# EAGLE design nice n simple 3340 v3 (EAGLE 9.6.2)
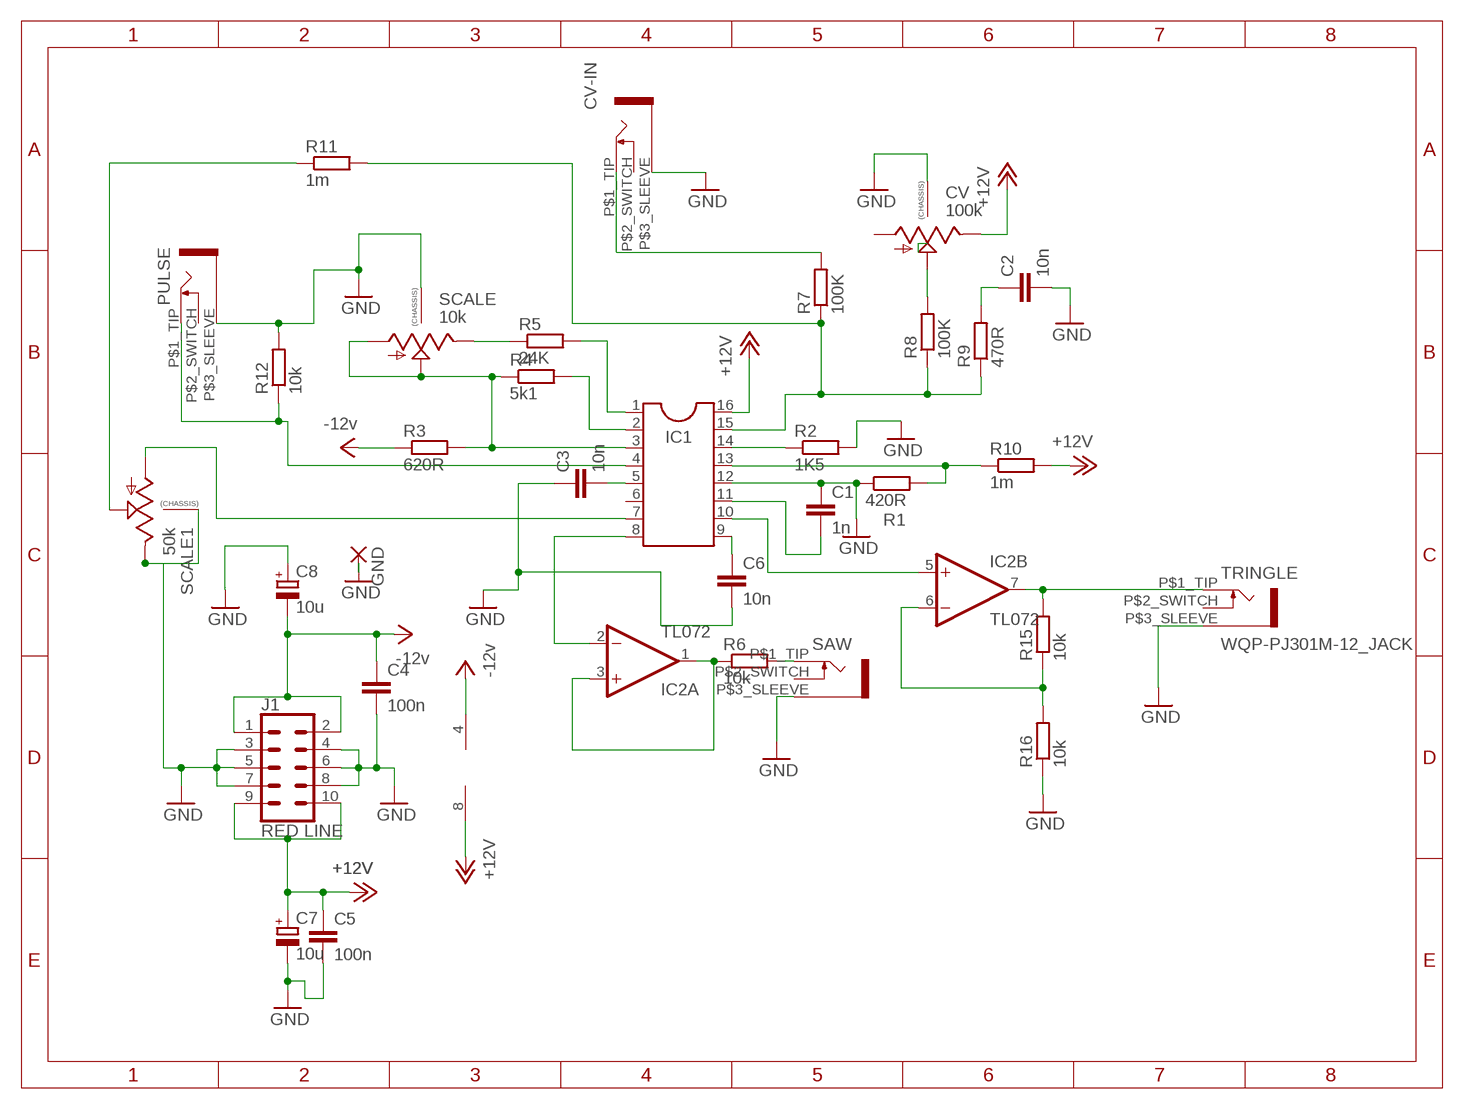
[diagram p0: schematic, sheet 1]

## Parts
C1  1n  C5/2.5  [C5B2.5]
C2  10n  C5/2.5  [C5B2.5]
C3  10n  C5/2.5  [C5B2.5]
C4  100n  C5/2.5  [C5B2.5]
C5  100n  C5/2.5  [C5B2.5]
C6  10n  C5/2.5  [C5B2.5]
C7  10u  CPOL-EUE1.8-4  [E1,8-4]
C8  10u  CPOL-EUE1.8-4  [E1,8-4]
CV  100k  9MM_SNAP-IN_POT_CHASSIS  [9MM_SNAP-IN_POT]
CV-IN  WQP-PJ301M-12_JACK  [WQP-PJ301M-12_JACK]
GND  WIREPAD1,6/0,9  [1,6/0,9]
IC1  CEM3340  DIL16S  [SOCKET-16]
IC2  TL072  TL072P  [DIL08]
J1  RED LINE  CONN_05X2SHD-NS  [2X5-SHROUDED-NS]
PULSE  WQP-PJ301M-12_JACK  [WQP-PJ301M-12_JACK]
R1  420R  R-EU_0207/7  [0207/7]
R2  1K5  R-EU_0207/7  [0207/7]
R3  620R  R-EU_0207/7  [0207/7]
R4  5k1  R-EU_0207/7  [0207/7]
R5  24K  R-EU_0207/7  [0207/7]
R6  10k  R-EU_0207/7  [0207/7]
R7  100K  R-EU_0207/7  [0207/7]
R8  100K  R-EU_0207/7  [0207/7]
R9  470R  R-EU_0207/7  [0207/7]
R10  1m  R-EU_0207/7  [0207/7]
R11  1m  R-EU_0207/7  [0207/7]
R12  10k  R-EU_0207/7  [0207/7]
R15  10k  R-EU_0207/7  [0207/7]
R16  10k  R-EU_0207/7  [0207/7]
SAW  WQP-PJ301M-12_JACK  [WQP-PJ301M-12_JACK]
SCALE  10k  9MM_SNAP-IN_POT_CHASSIS  [9MM_SNAP-IN_POT]
SCALE1  50k  9MM_SNAP-IN_POT_CHASSIS  [9MM_SNAP-IN_POT]
TRINGLE  WQP-PJ301M-12_JACK  [WQP-PJ301M-12_JACK]

## Nets
+12V: C5.1 C7.+ CV.3(E) IC1.16 IC2.8(P:V+) J1.9 J1.10 R10.2
-12V: C4.1 C8.- IC2.4(P:V-) J1.1 J1.2 R3.1 ; supply symbol labelled -12v
GND: C1.1 C2.2 C3.1 C4.2 C5.2 C6.2 C7.- C8.+ CV-IN.P$3_SLEEVE CV.CHASSIS1 CV.CHASSIS2 GND.1(P) IC1.12 J1.3 J1.4 J1.5 J1.6 J1.7 J1.8 PULSE.P$3_SLEEVE R1.1 R2.2 R12.2 R16.1 SAW.P$3_SLEEVE SCALE1.3(E) SCALE1.CHASSIS1 SCALE1.CHASSIS2 SCALE.CHASSIS1 SCALE.CHASSIS2 TRINGLE.P$3_SLEEVE
N$1: R5.1 SCALE.3(E)
N$2: IC1.3 R3.2 R4.1 SCALE.1(A) SCALE.2(S)
N$3: C1.2 IC1.11
N$4: IC1.15 R7.1 R8.1 R9.1 R11.2
N$5: IC1.13 R1.2 R10.1
N$6: IC1.14 R2.1
N$7: IC1.4 PULSE.P$1_TIP R12.1
N$8: IC1.2 R4.2
N$9: C6.1 IC1.9
N$10: C3.2 IC1.5
N$11: IC1.1 R5.2
N$12: IC2.6(B:-IN) R15.1 R16.2
N$13: IC1.8 IC2.2(A:-IN)
N$14: CV-IN.P$1_TIP R7.2
N$15: IC1.10 IC2.5(B:+IN)
N$16: IC2.1(A:OUT) IC2.3(A:+IN) R6.1
N$18: R6.2 SAW.P$1_TIP
N$20: IC2.7(B:OUT) R15.2 TRINGLE.P$1_TIP
N$22: IC1.7 SCALE1.1(A)
N$23: R11.1 SCALE1.2(S)
N$25: C2.1 R9.2
N$26: CV.2(S) R8.2
Unconnected: CV-IN.P$2_SWITCH CV.1(A) IC1.6 PULSE.P$2_SWITCH SAW.P$2_SWITCH TRINGLE.P$2_SWITCH

## Library data of the parts
C1-C6 = hexcapacitor-wima:C: CAPACITOR naming: grid - package width
C7 C8 = hexresistor:CPOL-EU: POLARIZED CAPACITOR, European symbol; SPICEPREFIX: C
CV SCALE SCALE1 = MusicThingModular:9MM_SNAP-IN_POT_CHASSIS: 9mm vertical snap-in pot, Alpha / Panasonic style, with a connection to the metal chassis for grounding
CV-IN PULSE SAW TRINGLE = MusicThingModular:WQP-PJ301M-12_JACK
GND = wirepad:WIREPAD: Wire PAD connect wire on PCB
IC1 = ic-package:DIL16: Dual In Line / Socket
IC2 = linear:TL072: OP AMP
J1 = SparkFun-Connectors:CONN_05X2: Multi connection point. Often used as Generic Header-pin footprint for 0.1 inch spaced/style header connections For AVR SPI programming port, see special device with nice symbol: "AVR_SPI_PROG_5x2.dev" You can populate with any combo of single row headers, but if you'd like an exact match, check these: 2x5 AVR ICSP Male Header <https://www.sparkfun.com/products/778> (PRT-00778) 2x5 Pin Shrouded Header <https://www.sparkfun.com/products/8506> (PRT-08506) On any of the 0.1 inch spaced packages, you can populate with these: Break Away Headers - Straight <https://www.sparkfun.com/products/116> (PRT-00116) Break Away Male Headers - Right Angle <https://www.sparkfun.com/products/553> (PRT-00553) Female Headers <https://www.sparkfun.com/products/115> (PRT-00115) Break Away Headers - Machine Pin <https://www.sparkfun.com/products/117> (PRT-00117) Break Away Female Headers - Swiss Machine Pin <https://www.sparkfun.com/products/743> (PRT-00743) Special note: the shrouded connector mates well with our 5x2 ribbon cables: 2x5 Pin IDC Ribbon Cable <https://www.sparkfun.com/products/8535> (PRT-08535); PROD_ID: CONN-08671; SF_ID: PRT-08506
R1-R12 R15 R16 = hexresistor:R-EU_: RESISTOR, European symbol; SPICEPREFIX: R

## Net classes
0 default: width 0.305 mm

## Board
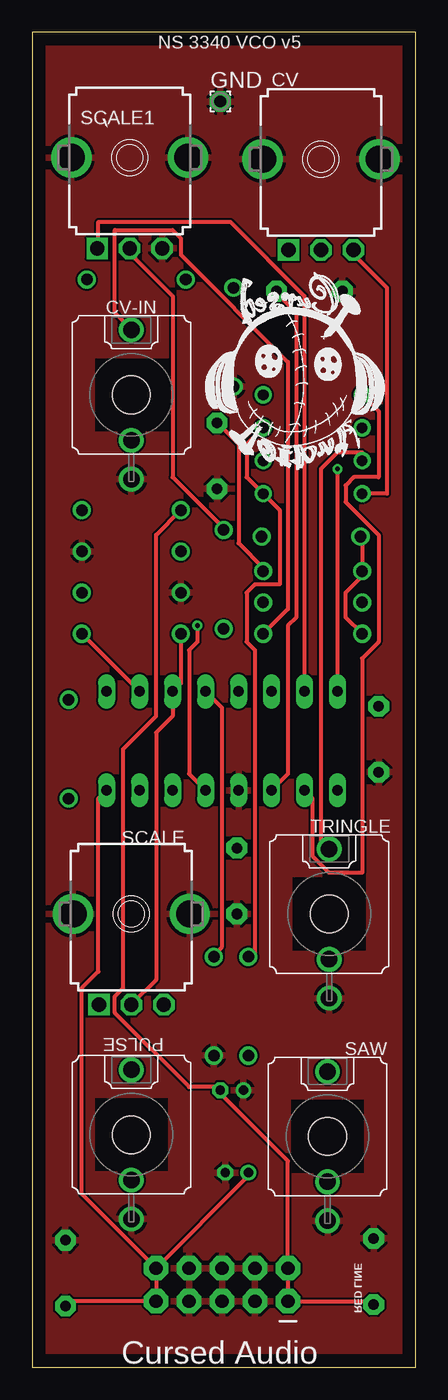
[diagram p1: board, top side]
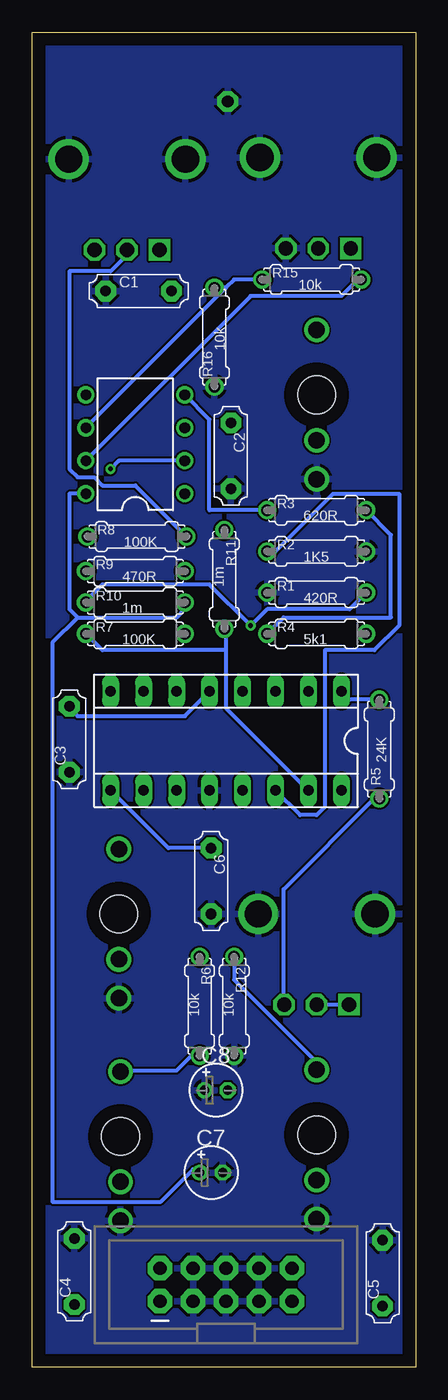
[diagram p2: board, bottom side, seen from below]

Size 29.52 x 102.86 mm. Coordinates in mm from the lower left corner, seen from the top.
Outline: 0,0 29.52,0 29.52,102.86 0,102.86 0,0
Copper layers (1*16): Top 0.035mm / dielectric 1.5mm / Bottom 0.035mm
Design rules "default": minimum track width 6mil, minimum drill 0.35mm, track to track 6mil, track to pad 6mil, pad to pad 6mil, via to via 6mil, smd to smd 6mil, copper to edge 40mil, drill to drill 6mil, minimum pad ring 10mil, minimum via ring 8mil, stop-mask expansion 4mil, vias tented up to drill 0mil, thermal gap 10mil

### Footprints (pad centres in the part's own frame; a part is rotated, then mirrored left to right if it is on the bottom)
C5B2.5 = drill 0.813 pad 1.6 octagon: 1 -2.54,0; 2 2.54,0
E1,8-4 = drill 0.711 pad 1.168: + -0.889,0 | drill 0.711 pad 1.168 octagon: - 0.889,0
9MM_SNAP-IN_POT = drill 1.1 square: 1 -2.5,-7 | drill 1.1 octagon: 2 0,-7; 3 2.5,-7 | drill 2.1 pad 2.794: CHASSIS1 -4.5,0; CHASSIS2 4.5,0
WQP-PJ301M-12_JACK = drill 1.27 pad 1.651: P$1_TIP 0,5; P$2_SWITCH 0,-3.5; P$3_SLEEVE 0,-6.5 | hole 2.921: 0,0
1,6/0,9 = drill 0.914 pad 1.6 octagon: 1 0,0
SOCKET-16 = drill 0.813 long: 1 -8.89,-3.81; 2 -6.35,-3.81; 3 -3.81,-3.81; 4 -1.27,-3.81; 5 1.27,-3.81; 6 3.81,-3.81; 7 6.35,-3.81; 8 8.89,-3.81; 9 8.89,3.81; 10 6.35,3.81; 11 3.81,3.81; 12 1.27,3.81; 13 -1.27,3.81; 14 -3.81,3.81; 15 -6.35,3.81; 16 -8.89,3.81
DIL08 = drill 0.813 pad 1.27: 1 -3.81,-3.81; 2 -1.27,-3.81; 3 1.27,-3.81; 4 3.81,-3.81; 5 3.81,3.81; 6 1.27,3.81; 7 -1.27,3.81; 8 -3.81,3.81
2X5-SHROUDED-NS = drill 1.016 pad 1.88 octagon: 1 -1.27,5.08; 2 1.27,5.08; 3 -1.27,2.54; 4 1.27,2.54; 5 -1.27,0; 6 1.27,0; 7 -1.27,-2.54; 8 1.27,-2.54; 9 -1.27,-5.08; 10 1.27,-5.08
0207/7 = drill 0.889: 1 -3.81,0; 2 3.81,0

### Placement (x,y rotation side)
C1  21.34,82.93 0 bottom
C2  14.22,70.23 270 bottom
C3  26.67,48.39 90 bottom
C4  26.29,7.37 90 bottom
C5  2.54,7.24 90 bottom
C6  15.75,37.47 270 bottom
C7  15.75,14.99 0 bottom
C8  15.37,21.34 0 bottom
CV  22.23,93.09 0 top
CV-IN  7.62,74.93 0 top
GND  14.48,97.54 0 top
IC1  14.61,48.26 180 bottom
IC2  21.59,71.12 90 bottom
J1  14.61,6.35 90 bottom
PULSE  7.62,17.91 0 top
R1  7.62,59.69 0 bottom
R2  7.62,62.87 0 bottom
R3  7.62,66.04 0 bottom
R4  7.62,56.52 0 bottom
R5  2.79,47.62 90 bottom
R6  16.64,27.81 270 bottom
R7  21.59,56.52 0 bottom
R8  21.46,64.01 0 bottom
R9  21.59,61.34 0 bottom
R10  21.59,58.93 0 bottom
R11  14.73,60.71 270 bottom
R12  13.97,27.81 270 bottom
R15  8,83.82 0 bottom
R16  15.49,79.38 90 bottom
SAW  22.73,17.78 0 top
SCALE  7.62,34.92 0 top
SCALE1  7.49,93.22 0 top
TRINGLE  22.86,34.92 0 top
U$1  [CA]  16,74.04 0 bottom

### Tracks (layer width: path | path; a pad name or v marks a point on that pad's centre or on a via)
+12V
  Top 0.305: IC2.8 27.3,67.31 27.3,83.19 24.77,85.73 CV.3 | C5.1 2.54,5.08 J1.9 J1.10 | J1.10 16.51,14.61 C7.+ | IC1.16 5.08,43.81 5.08,30.48 3.81,29.21 3.81,13.34 J1.10
  Bottom 0.305: 26.04,57.78 18.41,57.78 17.78,58.42 R10.2 | 26.04,57.78 26.67,58.42 26.67,67.31 IC2.8 | 26.04,57.78 27.94,55.88 27.94,12.7 19.68,12.7 17.14,15.24 C7.+
-12V
  Top 0.305: C4.1 26.04,5.08 J1.1 J1.2 19.68,15.88 14.61,20.95 C8.- 13.97,21.59 12.07,21.59 6.35,27.31 6.35,28.57 6.99,29.21 6.99,47.62 9.53,50.17 9.53,64.14 R3.1
  Bottom 0.305: IC2.4 15.88,73.03 15.88,66.04 R3.1
GND
  pour Top: -3.81,104.14 34.29,104.14 34.29,-5.08 29.21,-10.16 -6.35,-10.16 -3.81,-7.62
  pour Bottom: -6.35,104.14 31.75,104.14 31.75,-5.08 -1.27,-5.08 -3.81,-7.62 -3.81,101.6
N$1
  Bottom 0.305: R5.1 3.18,43.81 10.16,36.83 10.16,27.94 SCALE.3
N$2
  Top 0.305: R4.1 11.43,52.7 IC1.3 10.79,50.17 9.53,48.89 9.53,29.85 SCALE.2
  Bottom 0.305: SCALE.1 5.71,27.94 SCALE.2 | R3.2 1.9,64.14 1.9,57.78 10.16,57.78 R4.1
N$3
  Top 0.305: IC1.11 19.68,45.72 19.68,57.15 20.32,57.78 20.32,81.28 19.05,82.55 C1.2
N$4
  Top 0.305: R8.1 25.4,63.5 R9.1 25.4,60.96 24.13,59.69 24.13,57.78 R7.1
  Bottom 0.305: IC1.15 14.61,50.8 14.61,55.25 | 14.61,55.25 14.61,56.52 R11.2 | R7.1 24.13,55.25 14.61,55.25
N$5  (via drill 0.35)
  Top 0.305: IC1.13 12.07,45.72 12.07,55.25 12.7,55.88 v12.7,57.15
  Bottom 0.305: R1.2 5.08,58.42 11.43,58.42 v12.7,57.15 15.88,60.33 24.13,60.33 25.4,59.06 R10.1
N$6
  Bottom 0.305: IC1.14 8.89,42.55 7.62,42.55 6.99,43.18 6.99,55.25 3.18,55.25 1.27,57.15 1.27,67.31 6.35,67.31 10.79,62.87 R2.1
N$7
  Top 0.305: IC1.4 14.61,50.8 14.61,32.39 13.97,31.75 R12.1
  Bottom 0.305: R12.1 13.97,29.85 7.62,23.5 PULSE.P$1_TIP
N$8
  Top 0.305: R4.2 IC1.2
N$9
  Bottom 0.305: IC1.9 19.05,40 C6.1
N$10
  Bottom 0.305: IC1.5 17.78,50.17 26.04,50.17 26.67,50.8 C3.2
N$11
  Bottom 0.305: IC1.1 5.08,51.44 R5.2
N$12
  Bottom 0.305: 14.61,83.19 13.97,83.82 R15.1 | 14.61,83.19 IC2.6 | 14.61,83.19 R16.2
N$13  (via drill 0.35)
  Top 0.305: v23.5,69.22 IC1.8
  Bottom 0.305: v23.5,69.22 22.86,69.85 IC2.2
N$14
  Top 0.305: R7.2 19.68,58.42 19.68,77.47 11.43,85.73 11.43,87 10.79,87.63 6.35,87.63 6.35,81.28 7.62,80.01 CV-IN.P$1_TIP
N$15
  Top 0.305: IC1.10 21.59,43.81 21.59,39.37 22.86,38.1 25.4,38.1 25.4,54.61 26.67,55.88 26.67,64.14 24.13,66.67 24.13,67.95 24.77,68.58 26.67,68.58 26.67,73.66 IC2.5
N$16
  Top 0.305: IC2.3 16.51,71.12 16.51,68.58 IC2.1 19.05,66.04 19.05,60.33 17.14,60.33 16.51,59.69 16.51,55.88 17.14,55.25 17.14,31.75 R6.1
N$18
  Bottom 0.305: R6.2 17.14,24.13 18.41,22.86 22.23,22.86 SAW.P$1_TIP
N$20
  Top 0.305: IC2.7 25.4,70.48 23.5,70.48 22.23,69.22 22.23,40.64 22.86,40 TRINGLE.P$1_TIP
  Bottom 0.305: IC2.7 12.7,82.55 5.71,82.55 4.45,83.82 R15.2
N$22
  Top 0.305: IC1.7 20.96,82.55 15.24,88.27 5.08,88.27 5.08,86.36 SCALE1.1
N$23
  Top 0.305: R11.1 14.61,64.77 10.79,68.58 10.79,82.55 7.62,85.73 SCALE1.2
N$25
  Top 0.305: C2.1 15.88,71.12 15.88,63.5 17.78,61.59 R9.2
N$26
  Bottom 0.305: R8.2 21.59,67.95 24.13,67.95 24.77,68.58 26.04,68.58 26.67,69.22 26.67,84.45 23.5,84.45 22.23,85.73 CV.2

### Text on the board
tNames: NS 3340 VCO v5 | Cursed Audio